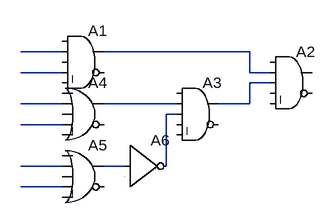
[diagram p0: schematic Draft_dogDoor.asc]
Draft_dogDoor.asc, the LTspice schematic file:
Version 4
SHEET 1 880 680
WIRE 64 16 0 16
WIRE 352 16 128 16
WIRE 64 48 0 48
WIRE 352 48 352 16
WIRE 384 48 352 48
WIRE 384 64 352 64
WIRE 64 96 0 96
WIRE 240 96 128 96
WIRE 352 96 352 64
WIRE 352 96 304 96
WIRE 240 112 224 112
WIRE 64 128 0 128
WIRE 64 192 0 192
WIRE 160 192 128 192
WIRE 224 192 224 112
WIRE 64 224 0 224
SYMBOL Digital\\and 96 -32 R0
SYMATTR InstName A1
SYMBOL Digital\\and 416 0 R0
SYMATTR InstName A2
SYMBOL Digital\\and 272 48 R0
SYMATTR InstName A3
SYMBOL Digital\\or 96 48 R0
SYMATTR InstName A4
SYMBOL Digital\\or 96 144 R0
SYMATTR InstName A5
SYMBOL Digital\\inv 160 128 R0
SYMATTR InstName A6

The netlist it stands for:
* Draft_dogDoor.asc
A1 0 N001 0 N003 0 0 N002 0 AND
A2 0 N002 N004 0 0 0 0 0 AND
A3 0 N006 N007 0 0 0 N004 0 AND
A4 0 N005 0 N008 0 0 N006 0 OR
A5 0 N009 0 N011 0 0 N010 0 OR
A6 N010 0 0 0 0 N007 0 0 BUF
.backanno
.end